# EAGLE design M_H_ext_rgb (EAGLE 9.6.2)
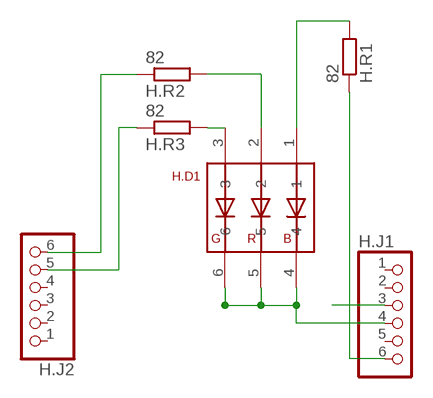
[diagram p0: schematic, sheet 1]

## Parts
H.D1  RGB_WW-FCE50TC-Q1  [RGB_WW-FCE50TC-Q1]
H.J1  PINHD-1X6  [1X06]
H.J2  PINHD-1X6  [1X06]
H.R1  82  R-EU_R0603  [R0603]
H.R2  82  R-EU_R0603  [R0603]
H.R3  82  R-EU_R0603  [R0603]

## Nets
GND: H.D1.4 H.D1.5 H.D1.6 H.J1.4
N$1: H.D1.1 H.R1.2
N$2: H.D1.3 H.R3.2
N$3: H.D1.2 H.R2.2
N$4: H.J1.6 H.R1.1
N$5: H.J2.6 H.R2.1
N$6: H.J2.5 H.R3.1
VDD: H.J1.3
Unconnected: H.J1.1 H.J1.2 H.J1.5 H.J2.1 H.J2.2 H.J2.3 H.J2.4

## Library data of the parts
H.D1 = hugo:RGB_WW-FCE50TC-Q1
H.J1 H.J2 = pinhead2:PINHD-1X6: PIN HEADER
H.R1-H.R3 = resistor:R-EU_: RESISTOR, European symbol

## Board
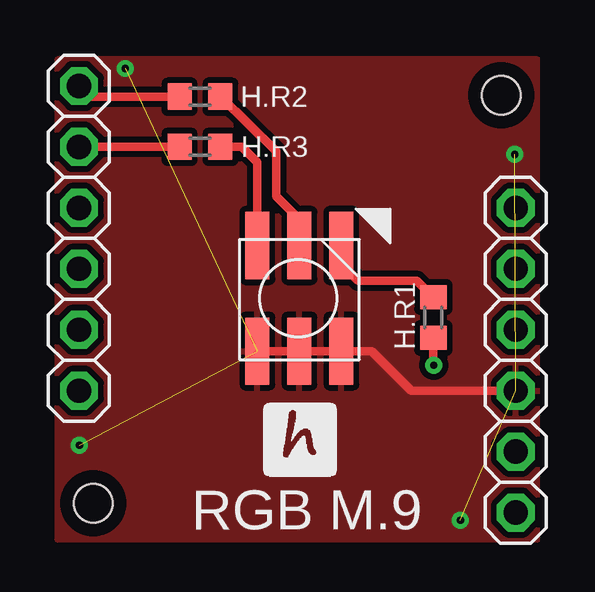
[diagram p1: board, top side]
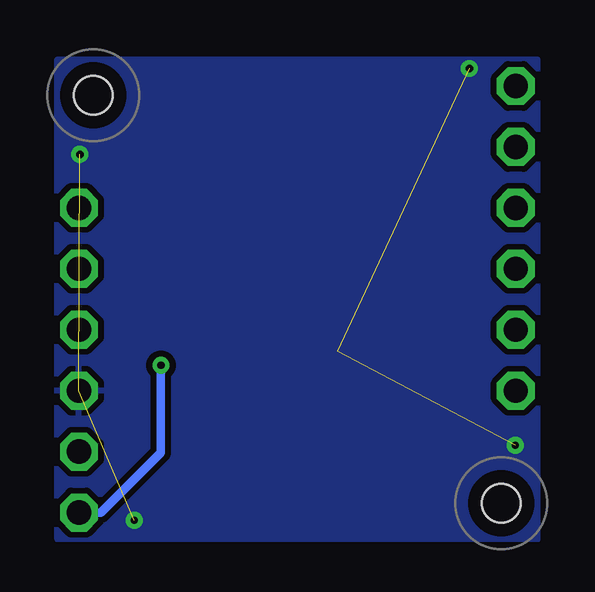
[diagram p2: board, bottom side, seen from below]

No outline drawn. Coordinates in mm, seen from the top.
Copper layers (1*16): Top 0.035mm / dielectric 1.5mm / Bottom 0.035mm
Design rules "default *": minimum track width 14mil, minimum drill 0.35mm, track to track 10mil, track to pad 10mil, pad to pad 10mil, via to via 10mil, smd to smd 10mil, copper to edge 10mil, drill to drill 15mil, minimum pad ring 10mil, minimum via ring 8mil, stop-mask expansion 4mil, vias tented up to drill 0mil, thermal gap 10mil
Holes 1.6 mm at 2,2 19,19
tRestrict: area 18,18 to 20,20; area 1,1 to 3,3
bRestrict: area 1,1 to 3,3; area 18,18 to 20,20

### Footprints (pad centres in the part's own frame; a part is rotated, then mirrored left to right if it is on the bottom)
RGB_WW-FCE50TC-Q1 = smd 1 x 2.8: 1 -1.778,-2.286; 2 -0.028,-2.286; 3 1.722,-2.286; 4 -1.778,2.114; 5 -0.028,2.114; 6 1.722,2.114
1X06 = drill 1.016 pad 1.575 octagon: 1 -6.35,0; 2 -3.81,0; 3 -1.27,0; 4 1.27,0; 5 3.81,0; 6 6.35,0
R0603 = smd 1 x 1.1: 1 -0.85,0; 2 0.85,0

### Placement (x,y rotation side)
H.D1  10.55,10.45 180 top
H.J1  19.6,7.96 270 top
H.J2  1.4,13.04 90 top
H.R1  16.17,9.74 90 top
H.R2  6.44,18.95 0 top
H.R3  6.44,16.86 0 top

### Tracks (layer width: path | path; a pad name or v marks a point on that pad's centre or on a via)
GND  (via drill 0.3)  (4 unrouted)
  Top 0.356: H.D1.6 H.D1.5 H.D1.4 13.6,8.34 15.25,6.69 H.J1.4
  other vias: 19.56,16.54 1.42,4.42 3.33,20.12 17.3,1.3
  pour Top (isolate 0.254): 0.5,20.5 0.5,0.5 20.5,0.5 20.5,20.5
  pour Bottom (isolate 0.254): 0.5,20.5 0.5,0.5 20.5,0.5 20.5,20.5
N$1
  Top 0.356: 12.38,12.79 H.D1.1 12.33,11.98 13.03,11.28 15.49,11.28 H.R1.2
N$2
  Top 0.356: H.R3.2 8.2,16.86 8.83,16.22 H.D1.3
N$3
  Top 0.356: H.D1.2 10.58,13.83 9.62,14.8 9.62,16.68 H.R2.2
N$4  (via drill 0.3)
  Top 0.356: H.R1.1 v16.17,7.75 v16.18,7.75
  Bottom 0.356: v16.18,7.75 16.18,4.12 18.69,1.61 H.J1.6
N$5
  Top 0.356: H.J2.6 1.84,18.95 H.R2.1
N$6
  Top 0.356: H.R3.1 2.19,16.86 2.18,16.85 H.J2.5

### Text on the board
tPlace: RGB M.9